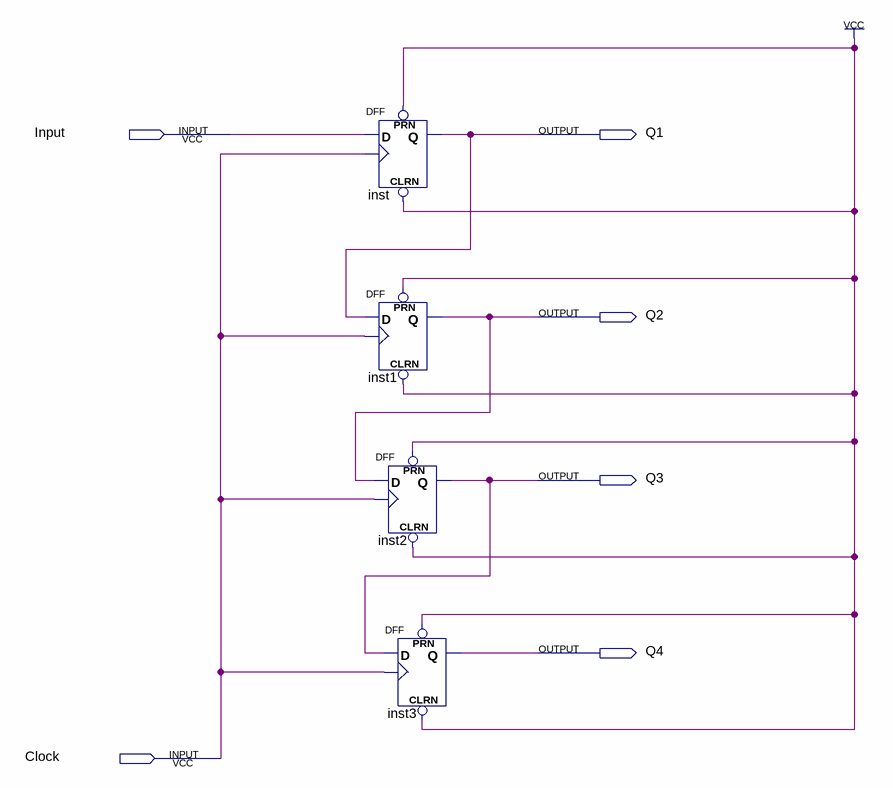
[diagram p0: schematic sheet]
// Quartus schematic FirstRegister.bdf as structural Verilog: 4 symbols, 6 pins
module FirstRegister (
  input  Input,
  input  Clock,
  output Q1,
  output Q2,
  output Q3,
  output Q4
);

  DFF inst (.CLRN(1'b1), .CLK(Clock), .D(Input), .PRN(1'b1), .Q(Q1));
  DFF inst1 (.CLRN(1'b1), .CLK(Clock), .D(Q1), .PRN(1'b1), .Q(Q2));
  DFF inst2 (.CLRN(1'b1), .CLK(Clock), .D(Q2), .PRN(1'b1), .Q(Q3));
  DFF inst3 (.CLRN(1'b1), .CLK(Clock), .D(Q3), .PRN(1'b1), .Q(Q4));
endmodule
